# EAGLE design mpiv2 (EAGLE 6.5.0)
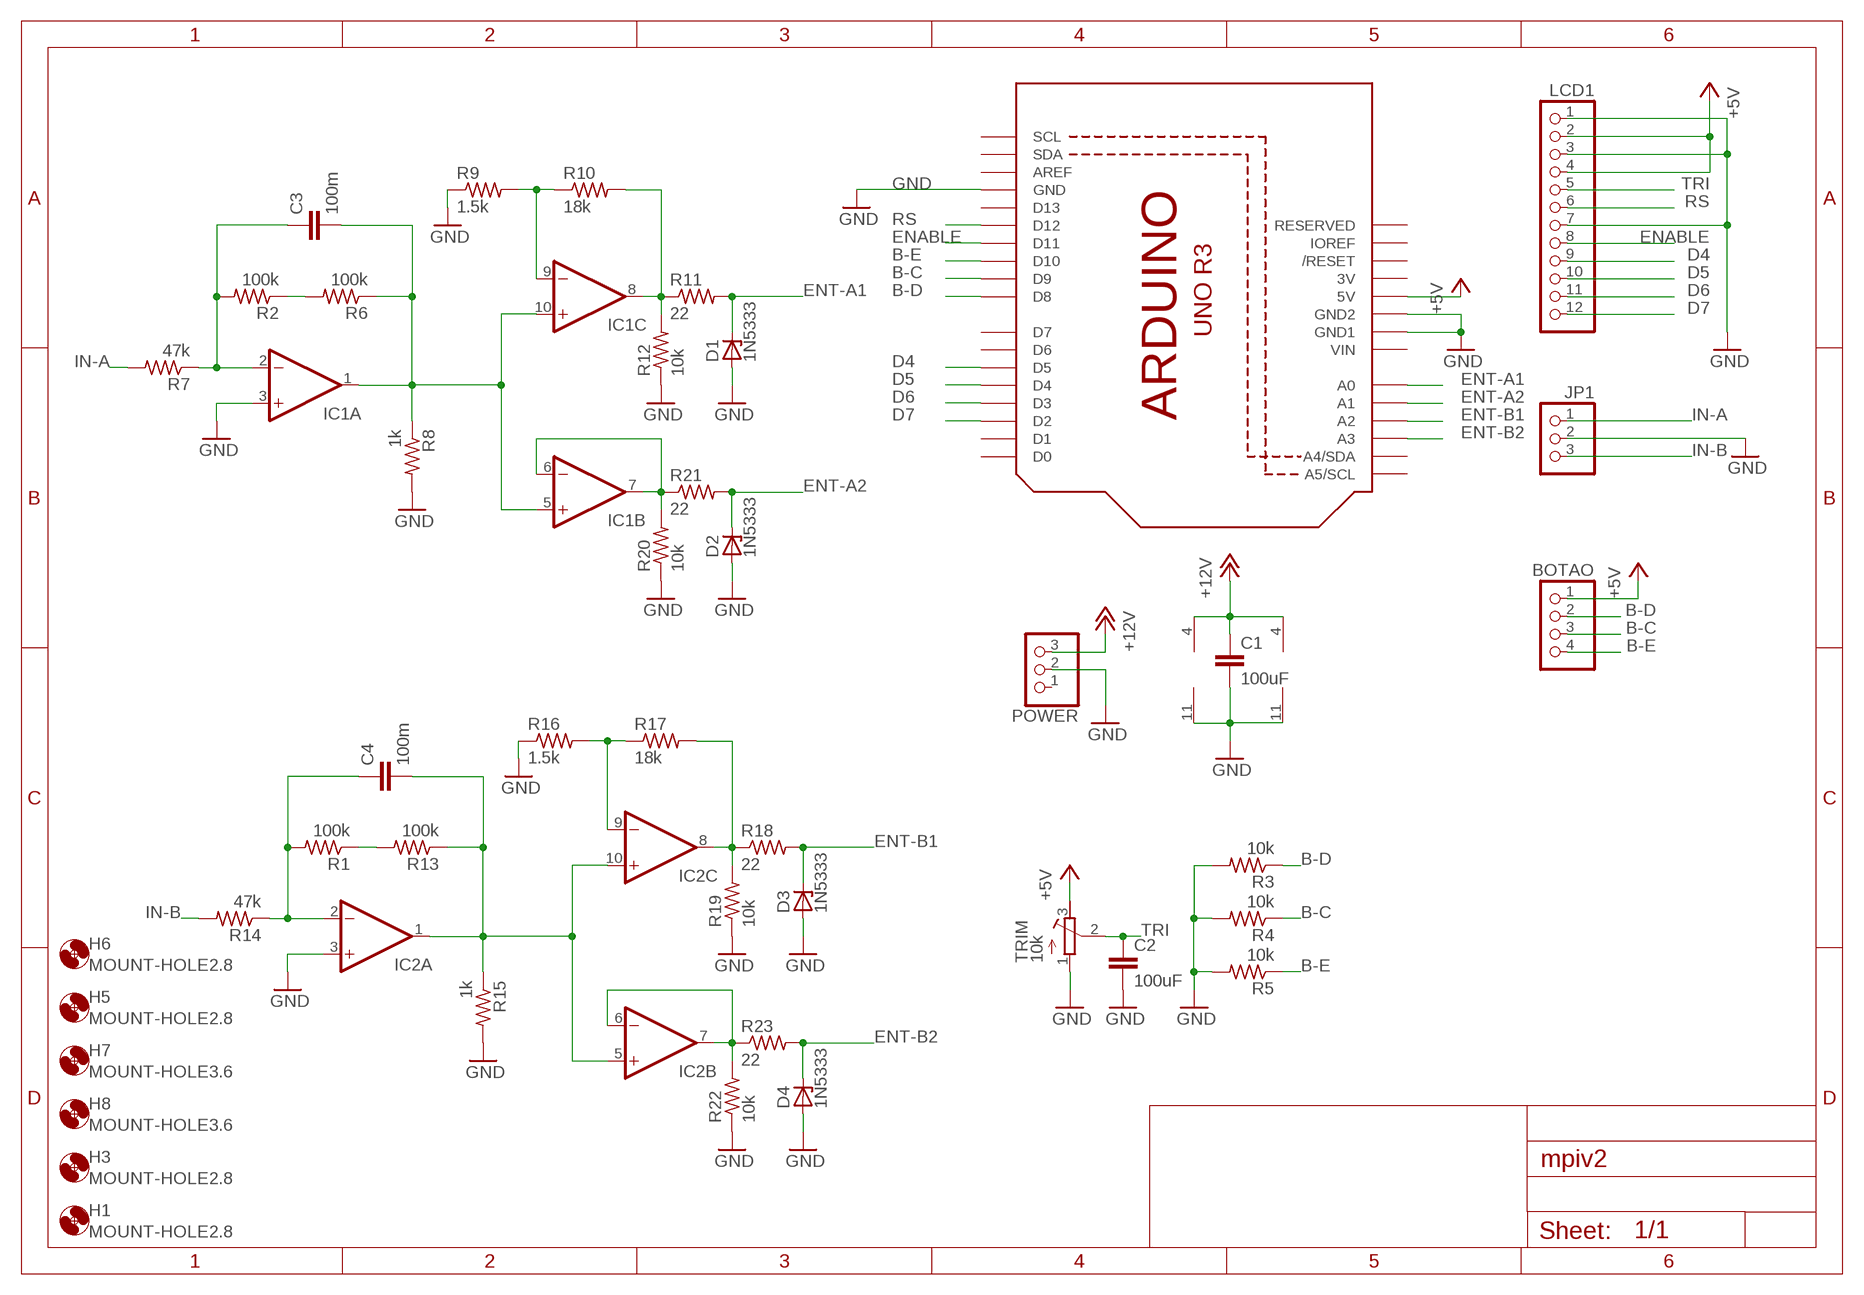
[diagram p0: schematic, sheet 1]

## Parts
BOTAO  HEADER-1X4  [1X04_OVAL]
C1  100uF  C-EU050-035X075  [C050-035X075]
C2  100uF  C-EU050-035X075  [C050-035X075]
C3  100m  C-EU075-032X103  [C075-032X103]
C4  100m  C-EU075-032X103  [C075-032X103]
D1  1N5333  [C1702-15]
D2  1N5333  [C1702-15]
D3  1N5333  [C1702-15]
D4  1N5333  [C1702-15]
H1  MOUNT-HOLE2.8  [2,8]
H3  MOUNT-HOLE2.8  [2,8]
H5  MOUNT-HOLE2.8  [2,8]
H6  MOUNT-HOLE2.8  [2,8]
H7  MOUNT-HOLE3.6  [3,6]
H8  MOUNT-HOLE3.6  [3,6]
IC1  4AMP_P4+11N  [DIL14]
IC2  4AMP_P4+11N  [DIL14]
JP1  PINHD-1X3  [1X03]
LCD1  PINHD-1X12  [1X12]
POWER  HEADER-1X3  [1X03_OVAL]
R1  100k  R-US_0207/10  [0207/10]
R2  100k  R-US_0207/10  [0207/10]
R3  10k  R-US_0207/10  [0207/10]
R4  10k  R-US_0207/10  [0207/10]
R5  10k  R-US_0207/10  [0207/10]
R6  100k  R-US_0207/10  [0207/10]
R7  47k  R-US_0207/10  [0207/10]
R8  1k  R-US_0207/10  [0207/10]
R9  1.5k  R-US_0207/10  [0207/10]
R10  18k  R-US_0207/10  [0207/10]
R11  22  R-US_0207/10  [0207/10]
R12  10k  R-US_0207/10  [0207/10]
R13  100k  R-US_0207/10  [0207/10]
R14  47k  R-US_0207/10  [0207/10]
R15  1k  R-US_0207/10  [0207/10]
R16  1.5k  R-US_0207/10  [0207/10]
R17  18k  R-US_0207/10  [0207/10]
R18  22  R-US_0207/10  [0207/10]
R19  10k  R-US_0207/10  [0207/10]
R20  10k  R-US_0207/10  [0207/10]
R21  22  R-US_0207/10  [0207/10]
R22  10k  R-US_0207/10  [0207/10]
R23  22  R-US_0207/10  [0207/10]
TRIM  10k  R-TRIMM74W  [RTRIM74W]
U1  ARDUINOR3-BPLACE  [ARDUINOR3-BPLACE]

## Nets
+5V: BOTAO.1 LCD1.2 LCD1.4 TRIM.3(A) U1.5V
+12V: C1.1 IC1.4(P:V+) IC2.4(P:V+) POWER.3
B-C: BOTAO.3 R4.1 U1.D9
B-D: BOTAO.2 R3.1 U1.D8
B-E: BOTAO.4 R5.1 U1.D10
D4: LCD1.9 U1.D5
D5: LCD1.10 U1.D4
D6: LCD1.11 U1.D3
D7: LCD1.12 U1.D2
ENABLE: LCD1.8 U1.D11
ENT-A1: D1.C R11.2 U1.A0
ENT-A2: D2.C R21.2 U1.A1
ENT-B1: D3.C R18.2 U1.A2
ENT-B2: D4.C R23.2 U1.A3
GND: C1.2 C2.2 D1.A D2.A D3.A D4.A IC1.3(A:+IN) IC1.11(P:V-) IC2.3(A:+IN) IC2.11(P:V-) JP1.2 LCD1.1 LCD1.3 LCD1.7 POWER.2 R3.2 R4.2 R5.2 R8.2 R9.1 R12.1 R15.2 R16.1 R19.1 R20.1 R22.1 TRIM.1(E) U1.GND U1.GND1 U1.GND2
IN-A: JP1.1 R7.2
IN-B: JP1.3 R14.2
N$1: C4.1 IC2.2(A:-IN) R1.2 R14.1
N$2: C3.1 IC1.2(A:-IN) R2.2 R7.1
N$3: R2.1 R6.2
N$4: C3.2 IC1.1(A:OUT) IC1.5(B:+IN) IC1.10(C:+IN) R6.1 R8.1
N$5: IC1.9(C:-IN) R9.2 R10.1
N$7: IC1.8(C:OUT) R10.2 R11.1 R12.2
N$8: IC1.6(B:-IN) IC1.7(B:OUT) R20.2 R21.1
N$11: R1.1 R13.2
N$12: C4.2 IC2.1(A:OUT) IC2.5(B:+IN) IC2.10(C:+IN) R13.1 R15.1
N$13: IC2.9(C:-IN) R16.2 R17.1
N$14: IC2.8(C:OUT) R17.2 R18.1 R19.2
N$15: IC2.6(B:-IN) IC2.7(B:OUT) R22.2 R23.1
RS: LCD1.6 U1.D12
TRI: C2.1 LCD1.5 TRIM.2(S)
Unconnected: IC1.12(D:+IN) IC1.13(D:-IN) IC1.14(D:OUT) IC2.12(D:+IN) IC2.13(D:-IN) IC2.14(D:OUT) POWER.1 U1.A4(A4/SDA) U1.A5(A5/SCL) U1.AREF U1.D0 U1.D1 U1.D6 U1.D7 U1.D13 U1.IOREF U1.RESERVED U1.RESET(/RESET) U1.SCL U1.SDA

## Power pins joined to a net without a drawn wire
3V: U1.3V
VIN: U1.VIN

## Library data of the parts
BOTAO = junior:HEADER-1X4: PIN HEADER
C1-C4 = rcl:C-EU: CAPACITOR, European symbol
D1-D4 = diode:1N5333: Z DIODE 3.3 V, 5W, 5 percent (Motorola)
H1 H3 H5-H8 = holes:MOUNT-HOLE: MOUNTING HOLE with drill center marker
IC1 IC2 = linear:4AMP_P4+11: OP AMP
JP1 = pinhead:PINHD-1X3: PIN HEADER
LCD1 = pinhead:PINHD-1X12: PIN HEADER
POWER = junior:HEADER-1X3: PIN HEADER
R1-R23 = rcl:R-US_: RESISTOR, American symbol
TRIM = resistor:R-TRIMM: Trimm resistor
U1 = junior:ARDUINOR3: This is a new object for the new Arduino R3 - with extra pins that you may want to use (such as IOref, and duplicated A4/A5

## Board
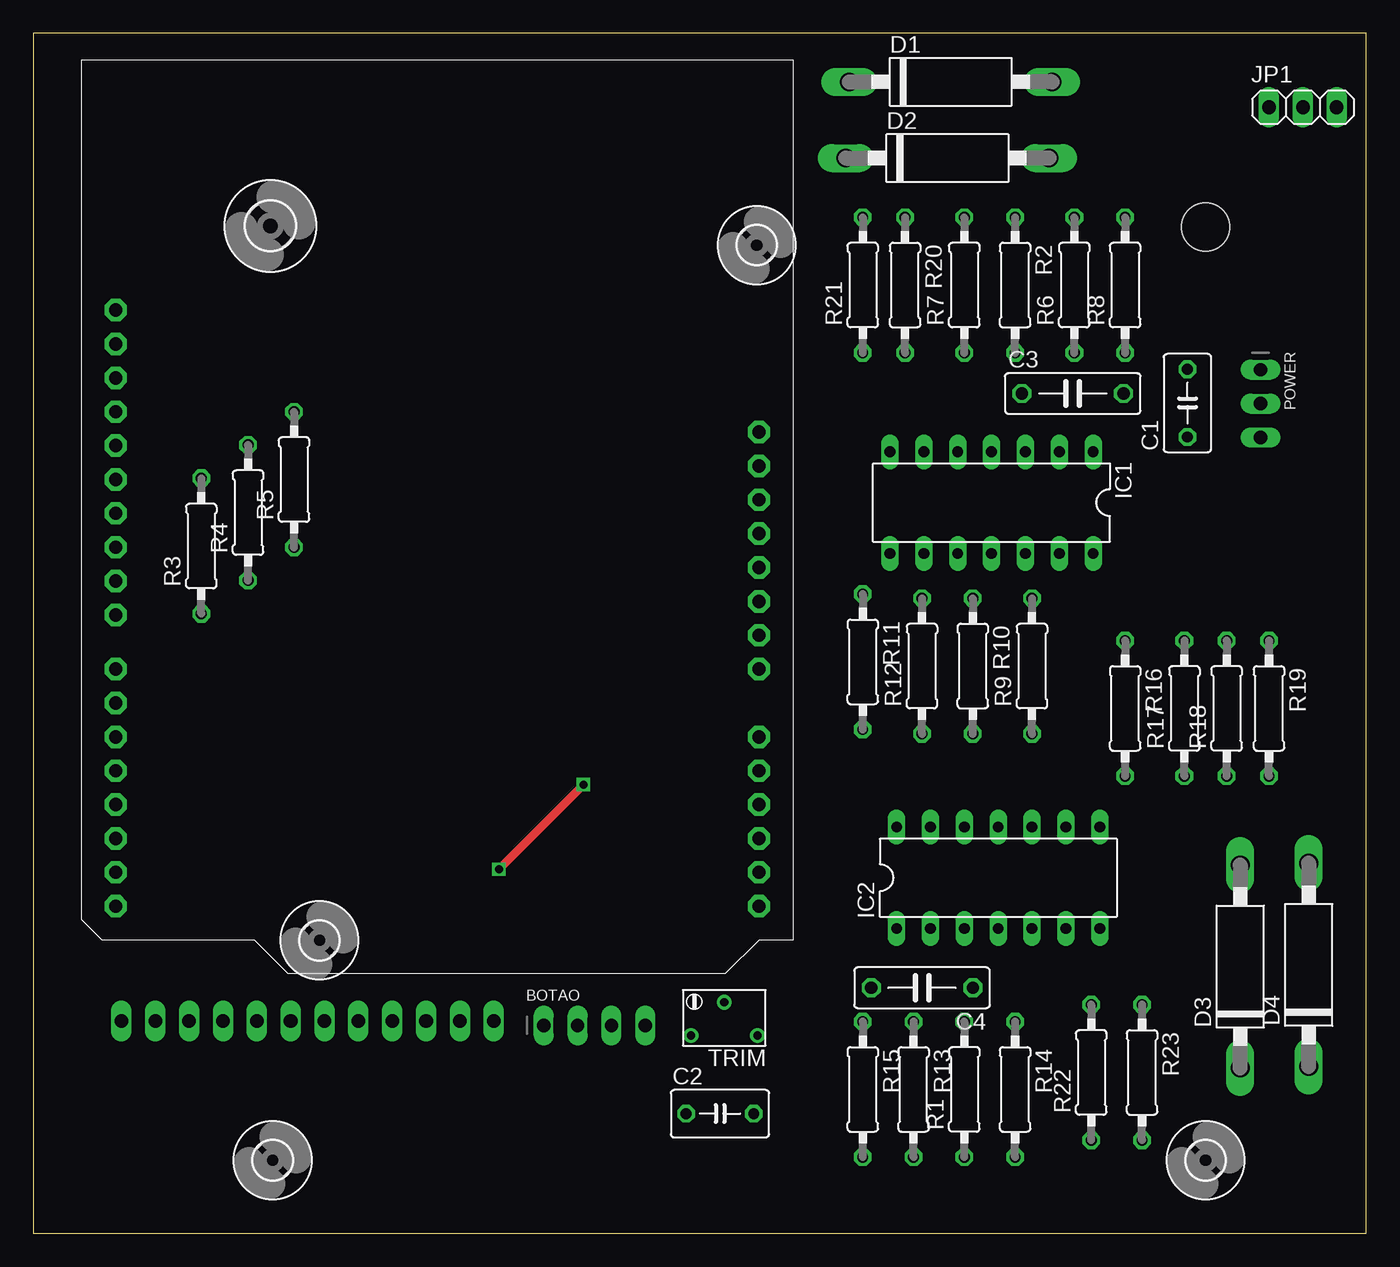
[diagram p1: board, top side]
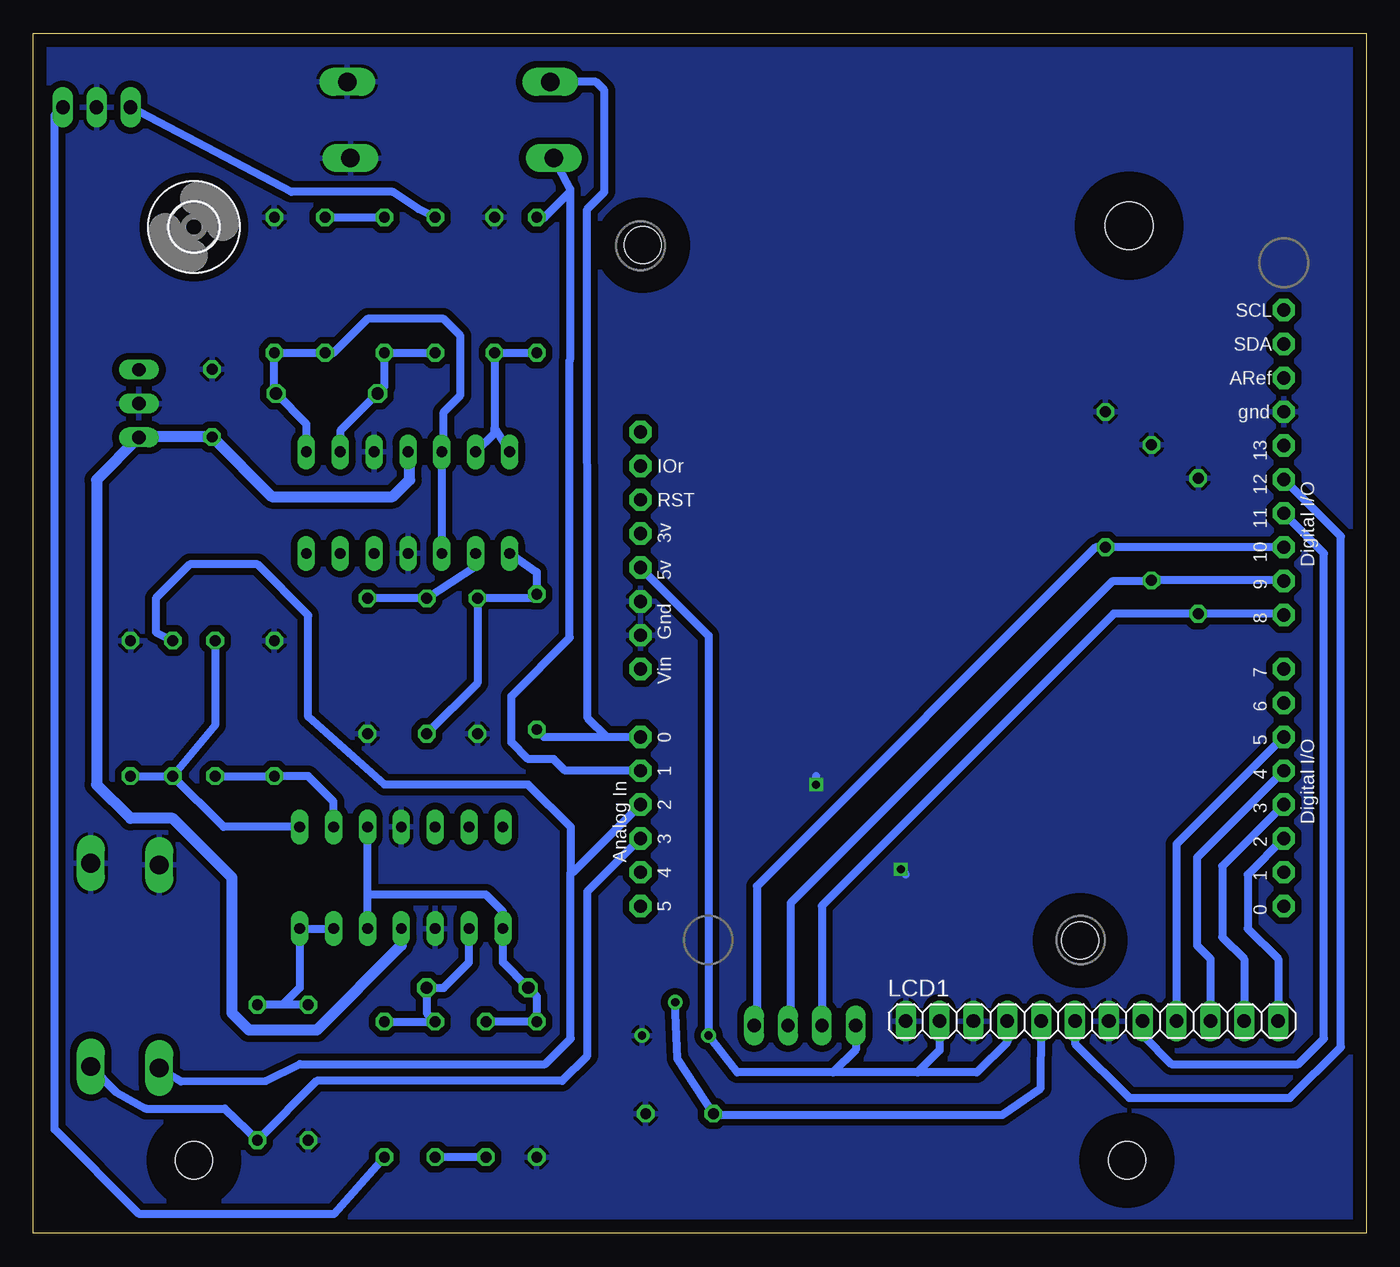
[diagram p2: board, bottom side, seen from below]

Size 100 x 90 mm. Coordinates in mm from the lower left corner, seen from the top.
Outline: 0,0 100,0 100,90 0,90 0,0
Copper layers (1*16): Top 0.05mm / dielectric 1.5mm / Bottom 0.05mm
Design rules "placa": minimum track width 0.5mm, minimum drill 24mil, track to track 0.5mm, track to pad 0.5mm, pad to pad 0.205mm, via to via 0.205mm, smd to smd 8mil, copper to edge 40mil, drill to drill 8mil, minimum pad ring 10mil, minimum via ring 8mil, stop-mask expansion 4mil, vias tented up to drill 0mil, thermal gap 10mil

### Footprints (pad centres in the part's own frame; a part is rotated, then mirrored left to right if it is on the bottom)
1X04_OVAL = drill 1 long: 1 -3.81,0; 2 -1.27,0; 3 1.27,0; 4 3.81,0
C050-035X075 = drill 0.813 octagon: 1 -2.54,0; 2 2.54,0
C075-032X103 = drill 0.914 octagon: 1 -3.81,0; 2 3.81,0
C1702-15 = drill 1.397 long: A 7.62,0; C -7.62,0
2,8 = hole 2.8: 0,0
3,6 = hole 3.6: 0,0
DIL14 = drill 0.813 long: 1 -7.62,-3.81; 2 -5.08,-3.81; 3 -2.54,-3.81; 4 0,-3.81; 5 2.54,-3.81; 6 5.08,-3.81; 7 7.62,-3.81; 8 7.62,3.81; 9 5.08,3.81; 10 2.54,3.81; 11 0,3.81; 12 -2.54,3.81; 13 -5.08,3.81; 14 -7.62,3.81
1X03 = drill 1.016 long: 1 -2.54,0; 2 0,0; 3 2.54,0
1X12 = drill 1.016 long: 1 -13.97,0; 2 -11.43,0; 3 -8.89,0; 4 -6.35,0; 5 -3.81,0; 6 -1.27,0; 7 1.27,0; 8 3.81,0; 9 6.35,0; 10 8.89,0; 11 11.43,0; 12 13.97,0
1X03_OVAL = drill 1 long: 1 -2.54,0; 2 0,0; 3 2.54,0
0207/10 = drill 0.813 octagon: 1 -5.08,0; 2 5.08,0
RTRIM74W = drill 0.61: 1 -1.25,-2.5; 2 1.25,0; 3 -1.25,2.5
ARDUINOR3-BPLACE = drill 1 pad 1.676 octagon: 3V 35.56,2.54; 5V 38.1,2.54; A0 50.8,2.54; A1 53.34,2.54; A2 55.88,2.54; A3 58.42,2.54; A4 60.96,2.54; A5 63.5,2.54; AREF 23.876,50.8; D0 63.5,50.8; D1 60.96,50.8; D2 58.42,50.8; D3 55.88,50.8; D4 53.34,50.8; D5 50.8,50.8; D6 48.26,50.8; D7 45.72,50.8; D8 41.656,50.8; D9 39.116,50.8; D10 36.576,50.8; D11 34.036,50.8; D12 31.496,50.8; D13 28.956,50.8; GND 26.416,50.8; GND1 43.18,2.54; GND2 40.64,2.54; IOREF 30.48,2.54; RESERVED 27.94,2.54; RESET 33.02,2.54; SCL 18.796,50.8; SDA 21.336,50.8; VIN 45.72,2.54

### Placement (x,y rotation side)
BOTAO  42.11,15.59 0 top
C1  86.59,62.27 90 top
C2  51.52,8.98 0 top
C3  77.98,62.99 0 top
C4  66.67,18.41 180 top
D1  68.82,86.36 0 top
D2  68.58,80.64 0 top
D3  90.55,20.01 90 top
D4  95.69,20.14 90 top
H1  54.28,74.11 0 top
H3  17.95,5.48 0 top
H5  87.95,5.48 0 top
H6  21.46,21.97 0 top
H7  17.78,75.56 0 top
H8  87.95,75.48 0 bottom
IC1  71.89,54.8 180 top
IC2  72.39,26.67 0 top
JP1  95.25,84.45 0 top
LCD1  20.58,15.92 0 bottom
POWER  92.08,62.23 270 top
R1  69.85,10.79 90 top
R2  73.66,71.12 270 top
R3  12.6,51.55 90 top
R4  16.11,54.05 90 top
R5  19.56,56.53 90 top
R6  78.11,71.12 90 top
R7  69.85,71.12 90 top
R8  81.92,71.12 90 top
R9  74.93,42.55 90 top
R10  70.48,42.55 270 top
R11  62.23,42.86 270 top
R12  66.67,42.55 90 top
R13  66.04,10.79 270 top
R14  73.66,10.79 270 top
R15  62.23,10.79 270 top
R16  81.92,39.37 270 top
R17  86.36,39.37 90 top
R18  89.53,39.37 90 top
R19  92.71,39.37 270 top
R20  65.41,71.12 270 top
R21  62.23,71.12 90 top
R22  79.38,12.06 90 top
R23  83.19,12.06 270 top
TRIM  51.84,16.08 90 top
U1  56.98,88.04 270 bottom

### Tracks (layer width: path | path; a pad name or v marks a point on that pad's centre or on a via)
+5V
  Bottom 0.61: U1.5V 49.34,44.83 TRIM.3 47.2,12.06 40.01,12.06 | LCD1.4 26.93,14.35 29.21,12.06 33.66,12.06 | 33.66,12.06 40.01,12.06 | LCD1.2 32.01,13.71 33.66,12.06 | BOTAO.1 38.3,13.77 40.01,12.06
+12V
  Bottom 0.813: IC1.4 71.75,58.47 71.75,56.52 73.03,55.24 82.1,55.24 C1.1 92.03,59.73 POWER.3 95.25,56.52 95.25,33.66 92.71,31.11 89.53,31.11 85.09,26.67 85.09,16.51 83.82,15.24 78.74,15.24 72.39,21.59 IC2.4
B-C
  Bottom 0.61: U1.D9 6.23,48.97 R4.1 16.19,48.9 19.05,48.9 43.18,24.77 43.18,15.79 BOTAO.3
B-D
  Bottom 0.61: U1.D8 6.27,46.47 R3.1 18.93,46.47 40.84,24.57 BOTAO.2
B-E
  Bottom 0.61: U1.D10 R5.1 20.3,51.45 45.72,26.04 45.72,15.79 BOTAO.4
D4
  Bottom 0.61: U1.D5 14.23,29.19 LCD1.9
D5
  Bottom 0.61: U1.D4 12.7,28.18 12.7,21.59 11.69,20.58 LCD1.10
D6
  Bottom 0.61: U1.D3 10.79,27.54 10.79,22.23 9.15,20.58 LCD1.11
D7
  Bottom 0.61: U1.D2 8.89,26.91 8.89,22.86 6.61,20.58 LCD1.12
ENABLE
  Bottom 0.61: LCD1.8 16.77,14.86 14.61,12.7 5.08,12.7 3.17,14.61 3.17,50.99 U1.D11
ENT-A1
  Bottom 0.61: D1.C 57.78,86.36 57.15,85.72 57.15,78.11 58.45,76.8 58.41,38.64 57.01,37.24 | 57.01,37.24 U1.A0 | R11.2 61.69,37.24 57.01,37.24
ENT-A2
  Bottom 0.61: 59.72,78.11 59.72,78.32 D2.C | 59.72,78.11 59.72,65.62 59.77,65.42 59.76,44.68 64.14,40.3 64.14,36.83 62.87,35.56 60.96,35.56 60.1,34.7 U1.A1 | R21.2 61.63,76.2 59.72,78.11
ENT-B1
  Bottom 0.61: R18.2 90.81,45.09 90.81,47.62 88.27,50.16 83.19,50.16 79.38,46.35 79.38,38.73 73.66,33.66 62.87,33.66 59.69,30.48 59.69,27.08 | D3.C 88.92,11.41 82.55,11.43 80.01,12.7 61.59,12.7 59.69,14.61 59.69,27.08 | 59.69,27.08 59.52,27.08 U1.A2
ENT-B2
  Bottom 0.61: D4.C 93.78,10.6 91.56,9.36 85.63,9.36 R23.2 78.74,11.43 60.33,11.43 58.42,13.34 58.42,25.64 U1.A3
GND  (via drill 0.6)
  Top 0.61: v34.92,27.3 v41.27,33.66
  Bottom 0.61: 34.55,26.93 v34.92,27.3 | v41.27,33.66 41.27,34.29
  pour Bottom: 0,90 100,90 100,0 99.84,0.14 0,0
IN-A
  Bottom 0.61: R7.2 71.12,76.83 73.03,78.11 80.64,78.11 JP1.1
IN-B
  Bottom 0.61: R14.2 77.44,1.44 92.05,1.44 98.4,7.79 98.4,83.85 JP1.3
N$1
  Bottom 0.61: R14.1 R1.2 70.48,16.51 C4.1 69.22,18.41 67.31,20.32 IC2.2
N$2
  Bottom 0.61: IC1.2 76.97,60.19 C3.1 73.66,63.5 R2.2 R7.1
N$3
  Bottom 0.61: R6.2 R2.1
N$4
  Bottom 0.61: IC1.10 IC1.5 69.22,58.75 69.22,61.59 67.94,62.87 67.94,67.31 69.22,68.58 74.93,68.58 77.47,66.04 R6.1 R8.1 81.92,63.11 C3.2 79.51,60.71 IC1.1
N$5
  Bottom 0.61: R9.2 R10.1 66.81,50.03 IC1.9
N$7
  Bottom 0.61: IC1.8 62.23,49.58 R11.1 62.23,47.62 R12.2 66.67,41.27 R10.2
N$8
  Bottom 0.61: 65.41,60.38 R20.2 R21.1 | 65.41,60.38 IC1.7 | IC1.6 65.41,60.02 65.41,60.38
N$11
  Bottom 0.61: R13.2 R1.1
N$12
  Bottom 0.61: R13.1 R15.1 62.23,17.78 C4.2 64.77,20.32 IC2.1 64.77,24.13 66.04,25.4 74.93,25.4 | IC2.5 74.93,25.4 | 74.93,25.4 IC2.10
N$13
  Bottom 0.61: R17.1 R16.2 79.38,34.29 77.47,32.38 IC2.9
N$14
  Bottom 0.61: R19.2 R18.1 | IC2.8 85.72,30.48 R18.1 | R17.2 86.36,38.1 R18.1
N$15
  Bottom 0.61: R22.2 81.28,17.14 | 81.28,17.14 R23.1 | IC2.6 IC2.7 80.01,18.41 81.28,17.14
RS
  Bottom 0.61: LCD1.6 21.85,14.23 17.78,10.16 5.71,10.16 1.91,13.97 1.91,52.27 U1.D12
TRI
  Bottom 0.61: TRIM.2 51.67,13.1 C2.1 48.73,8.89 27.3,8.89 24.41,10.88 24.39,15.62 LCD1.5